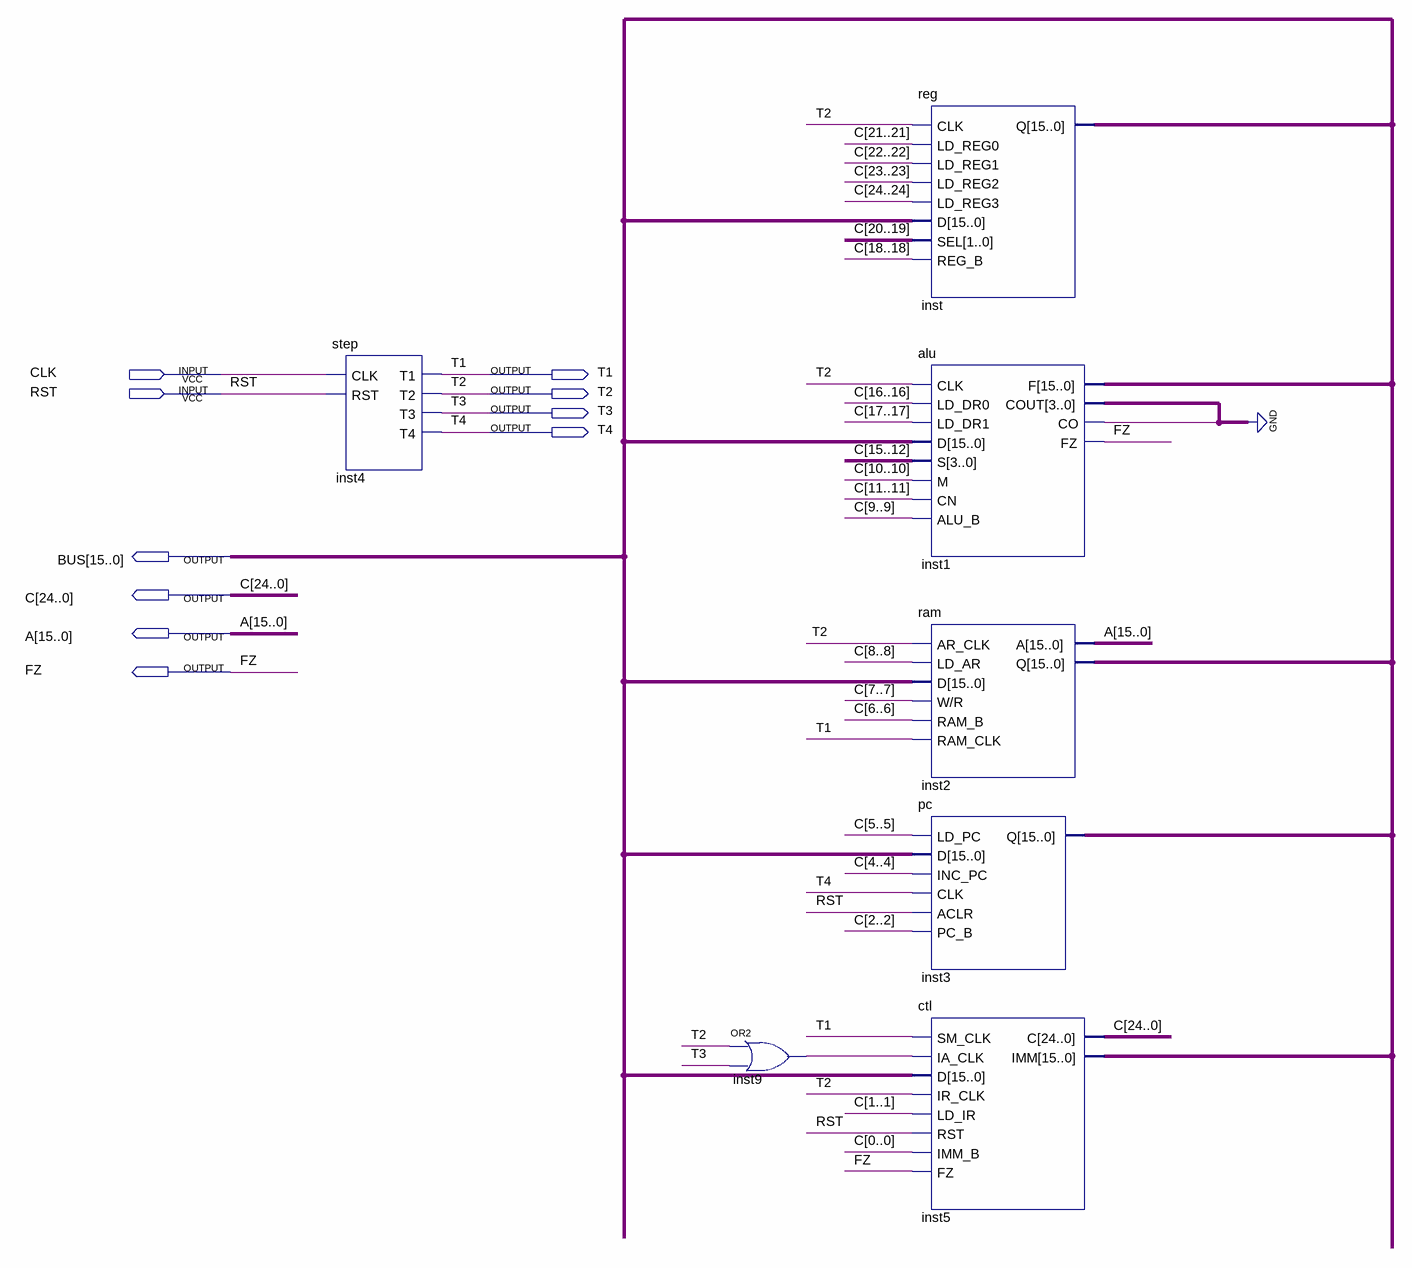
[diagram p0: schematic sheet]
// Quartus schematic model.bdf as structural Verilog: 7 symbols, 10 pins
module model (
  input  CLK,
  input  RST,
  output T1,
  output T2,
  output T3,
  output T4,
  output [15:0] BUS,
  output [24:0] C,
  output [15:0] A,
  output FZ
);

  wire inst1_co, inst9_out;
  wire [3:0] inst1_cout;

  step inst4 (.CLK(CLK), .RST(RST), .T1(T1), .T2(T2), .T3(T3), .T4(T4));
  or inst9 (inst9_out, T2, T3);
  \reg  inst (
    .CLK(T2), .LD_REG0(C[21]), .LD_REG1(C[22]), .LD_REG2(C[23]), .LD_REG3(C[24]), .D(BUS), .SEL(C[20:19]),
    .REG_B(C[18]), .Q(BUS));
  alu inst1 (
    .CLK(T2), .LD_DR0(C[16]), .LD_DR1(C[17]), .D(BUS), .S(C[15:12]), .M(C[10]), .CN(C[11]), .ALU_B(C[9]),
    .F(BUS), .COUT(inst1_cout), .CO(inst1_co), .FZ(FZ));
  ram inst2 (.AR_CLK(T2), .LD_AR(C[8]), .D(BUS), .\W/R (C[7]), .RAM_B(C[6]), .RAM_CLK(T1), .A(A), .Q(BUS));
  pc inst3 (.LD_PC(C[5]), .D(BUS), .INC_PC(C[4]), .CLK(T4), .ACLR(RST), .PC_B(C[2]), .Q(BUS));
  ctl inst5 (
    .SM_CLK(T1), .IA_CLK(inst9_out), .D(BUS), .IR_CLK(T2), .LD_IR(C[1]), .RST(RST), .IMM_B(C[0]), .FZ(FZ),
    .C(C), .IMM(BUS));
  // also tied to GND on the sheet: {inst1_cout[0], inst1_cout[1], inst1_cout[2], inst1_cout[3]}
endmodule
